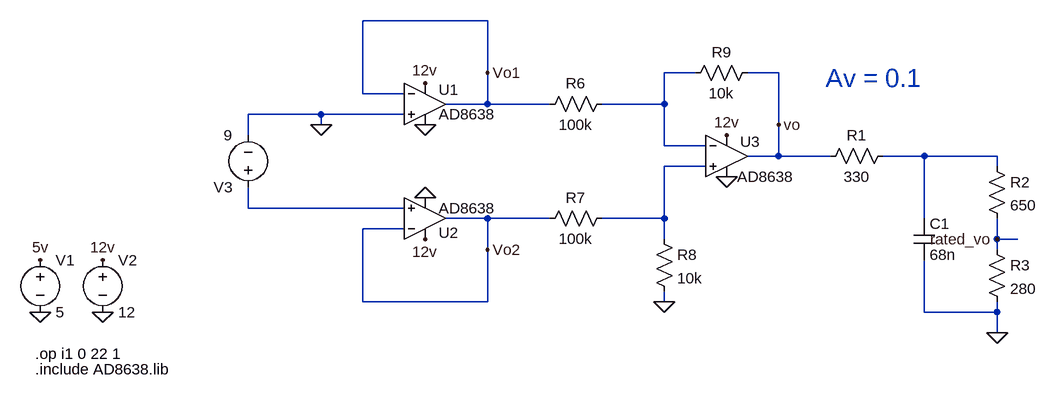
[diagram p0: schematic voltage-conditioning.asc]
voltage-conditioning.asc, the LTspice schematic file:
Version 4
SHEET 1 1168 732
WIRE 224 -64 32 -64
WIRE 224 16 224 -64
WIRE 544 16 496 16
WIRE 672 16 624 16
WIRE 32 48 32 -64
WIRE 96 48 32 48
WIRE 224 64 224 16
WIRE 224 64 160 64
WIRE 320 64 224 64
WIRE 496 64 496 16
WIRE 496 64 400 64
WIRE -32 80 -144 80
WIRE 96 80 -32 80
WIRE -32 96 -32 80
WIRE 672 96 672 16
WIRE -144 112 -144 80
WIRE 496 128 496 64
WIRE 560 128 496 128
WIRE 672 144 672 96
WIRE 672 144 624 144
WIRE 752 144 672 144
WIRE 896 144 832 144
WIRE 1008 144 896 144
WIRE 560 160 496 160
WIRE 1008 160 1008 144
WIRE -144 224 -144 192
WIRE 96 224 -144 224
WIRE 224 240 160 240
WIRE 320 240 224 240
WIRE 496 240 496 160
WIRE 496 240 400 240
WIRE 896 240 896 144
WIRE 96 256 32 256
WIRE 496 272 496 240
WIRE 1008 272 1008 240
WIRE 1040 272 1008 272
WIRE 224 288 224 240
WIRE 1008 288 1008 272
WIRE 32 368 32 256
WIRE 224 368 224 288
WIRE 224 368 32 368
WIRE 496 368 496 352
WIRE 896 384 896 304
WIRE 1008 384 1008 368
WIRE 1008 384 896 384
WIRE 1008 416 1008 384
FLAG 128 96 0
FLAG 128 32 12v
FLAG -464 384 0
FLAG 224 16 Vo1
FLAG -368 384 0
FLAG -368 304 12v
FLAG 128 208 0
FLAG 128 272 12v
FLAG 224 288 Vo2
FLAG 496 368 0
FLAG 592 176 0
FLAG 592 112 12v
FLAG 672 96 vo
FLAG 1008 416 0
FLAG 1008 272 rated_vo
FLAG -464 304 5v
FLAG -32 96 0
DATAFLAG 896 144 ""
DATAFLAG 672 144 ""
DATAFLAG 1040 272 ""
SYMBOL OpAmps\\UniversalOpAmp 128 64 R0
WINDOW 0 21 -22 Left 2
WINDOW 3 21 16 Left 2
SYMATTR InstName U1
SYMATTR Value AD8638
SYMATTR SpiceModel ""
SYMATTR Value2 ""
SYMATTR SpiceLine ""
SYMBOL voltage -464 288 R0
WINDOW 123 0 0 Left 0
WINDOW 39 0 0 Left 0
SYMATTR InstName V1
SYMATTR Value 5
SYMBOL voltage -368 288 R0
WINDOW 123 0 0 Left 0
WINDOW 39 0 0 Left 0
SYMATTR InstName V2
SYMATTR Value 12
SYMBOL OpAmps\\UniversalOpAmp 128 240 M180
WINDOW 0 21 -22 Left 2
WINDOW 3 21 16 Left 2
SYMATTR InstName U2
SYMATTR Value AD8638
SYMATTR SpiceModel ""
SYMATTR Value2 ""
SYMATTR SpiceLine ""
SYMBOL OpAmps\\UniversalOpAmp 592 144 R0
WINDOW 0 21 -22 Left 2
SYMATTR InstName U3
SYMATTR Value AD8638
SYMATTR SpiceModel ""
SYMATTR Value2 ""
SYMATTR SpiceLine ""
SYMBOL res 416 48 R90
WINDOW 0 0 56 VBottom 2
WINDOW 3 32 56 VTop 2
SYMATTR InstName R6
SYMATTR Value 100k
SYMBOL res 416 224 R90
WINDOW 0 0 56 VBottom 2
WINDOW 3 32 56 VTop 2
SYMATTR InstName R7
SYMATTR Value 100k
SYMBOL res 480 256 R0
SYMATTR InstName R8
SYMATTR Value 10k
SYMBOL res 640 0 R90
WINDOW 0 0 56 VBottom 2
WINDOW 3 32 56 VTop 2
SYMATTR InstName R9
SYMATTR Value 10k
SYMBOL res 848 128 R90
WINDOW 0 0 56 VBottom 2
WINDOW 3 32 56 VTop 2
SYMATTR InstName R1
SYMATTR Value 330
SYMBOL res 992 144 R0
SYMATTR InstName R2
SYMATTR Value 650
SYMBOL res 992 272 R0
SYMATTR InstName R3
SYMATTR Value 280
SYMBOL cap 880 240 R0
SYMATTR InstName C1
SYMATTR Value 68n
SYMBOL voltage -144 208 R180
WINDOW 123 0 0 Left 0
WINDOW 39 0 0 Left 0
SYMATTR InstName V3
SYMATTR Value 9
TEXT -472 448 Left 2 !.op i1 0 22 1
TEXT -472 472 Left 2 !.include AD8638.lib
TEXT 744 24 Left 4 ;Av = 0.1

The netlist it stands for:
* voltage-conditioning.asc
XU1 0 Vo1 12v 0 Vo1 AD8638  ; pins In+ In- V+ V- OUT
V1 5v 0 5
V2 12v 0 12
XU2 N004 Vo2 12v 0 Vo2 AD8638  ; pins In+ In- V+ V- OUT
XU3 N003 N001 12v 0 vo AD8638  ; pins In+ In- V+ V- OUT
R6 N001 Vo1 100k
R7 N003 Vo2 100k
R8 N003 0 10k
R9 vo N001 10k
R1 N002 vo 330
R2 N002 rated_vo 650
R3 rated_vo 0 280
C1 N002 0 68n
V3 N004 0 9
.op i1 0 22 1
.include AD8638.lib
* Av = 0.1
.lib UniversalOpAmp1.lib
.backanno
.end